# EAGLE schematic metronome (EAGLE 6.6.0)
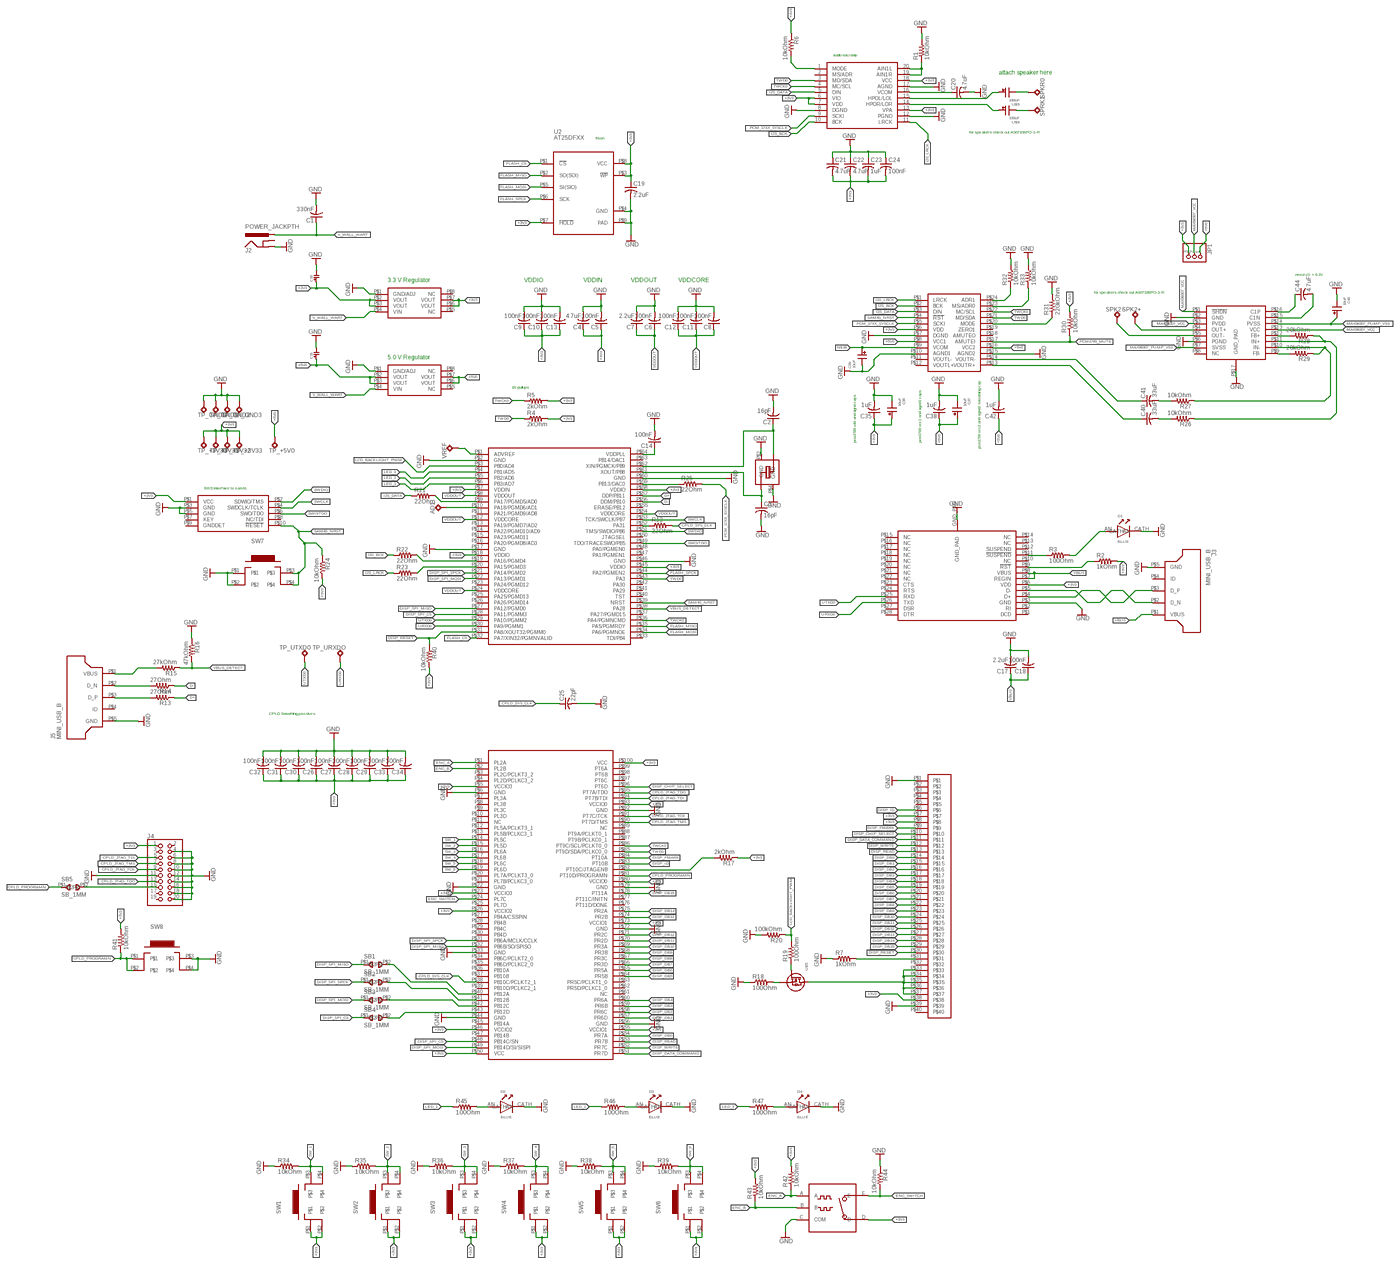
[diagram p0: schematic, sheet 1, overview]
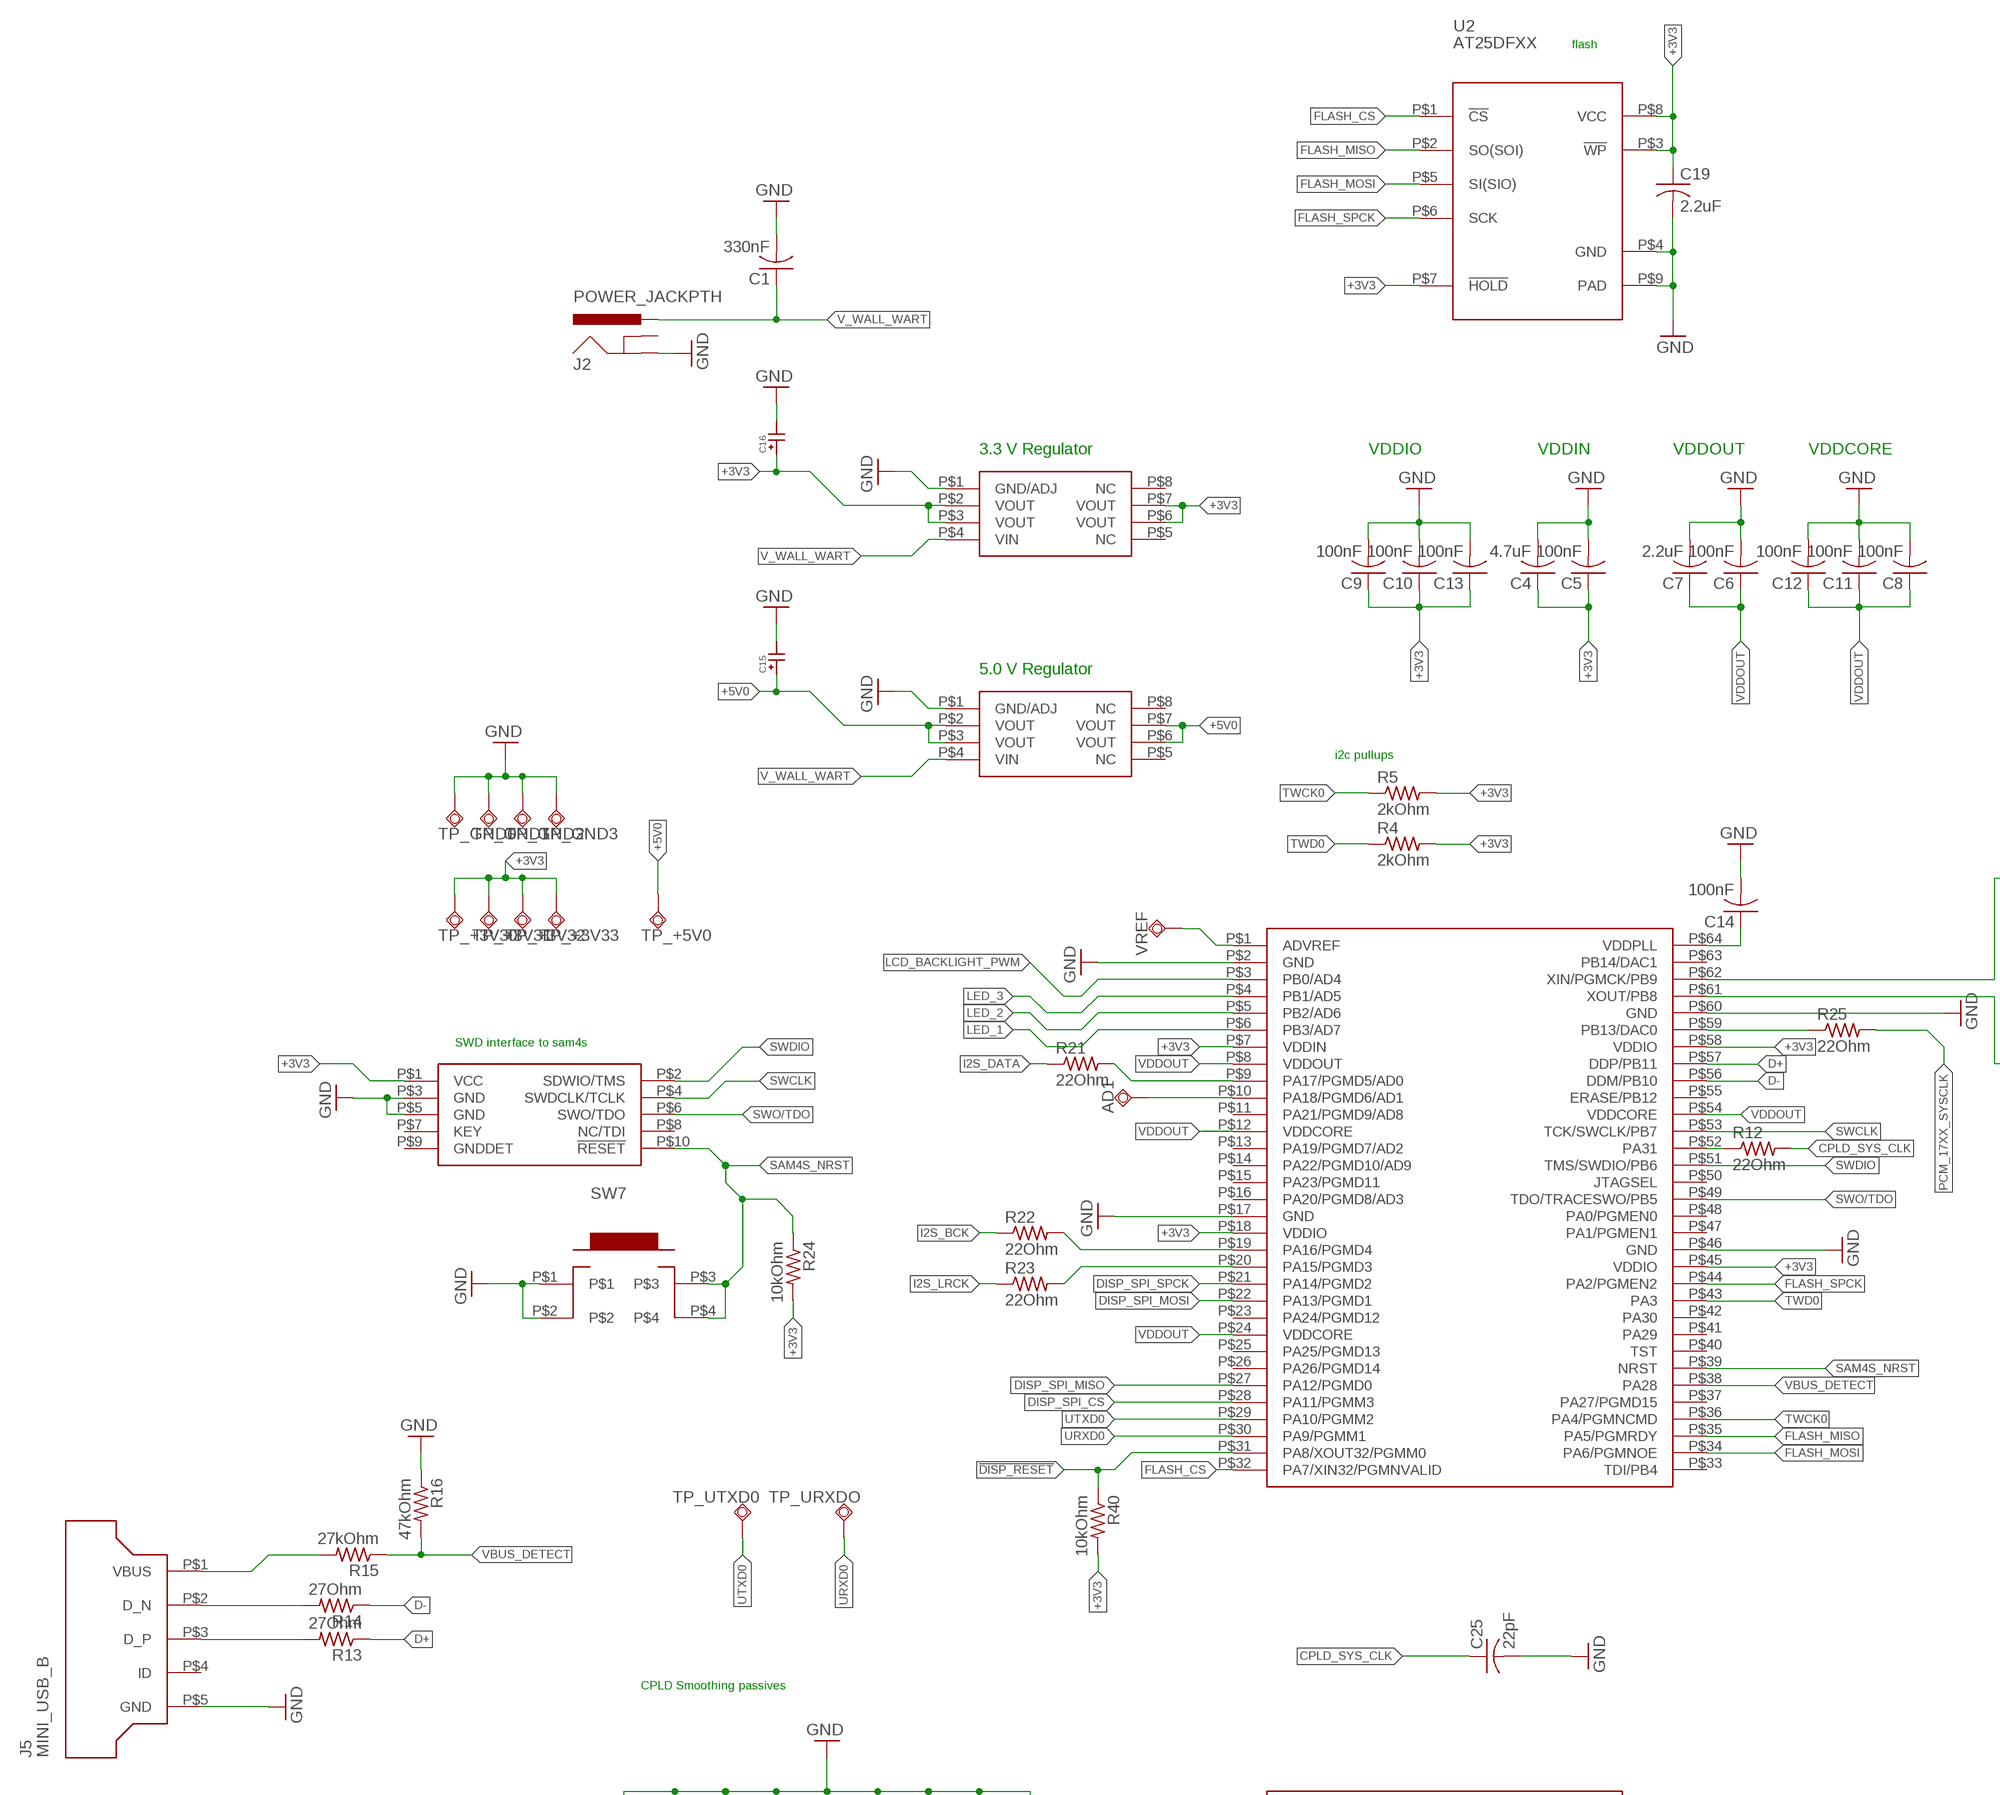
[diagram p1: schematic, sheet 1, part 1 of 4]
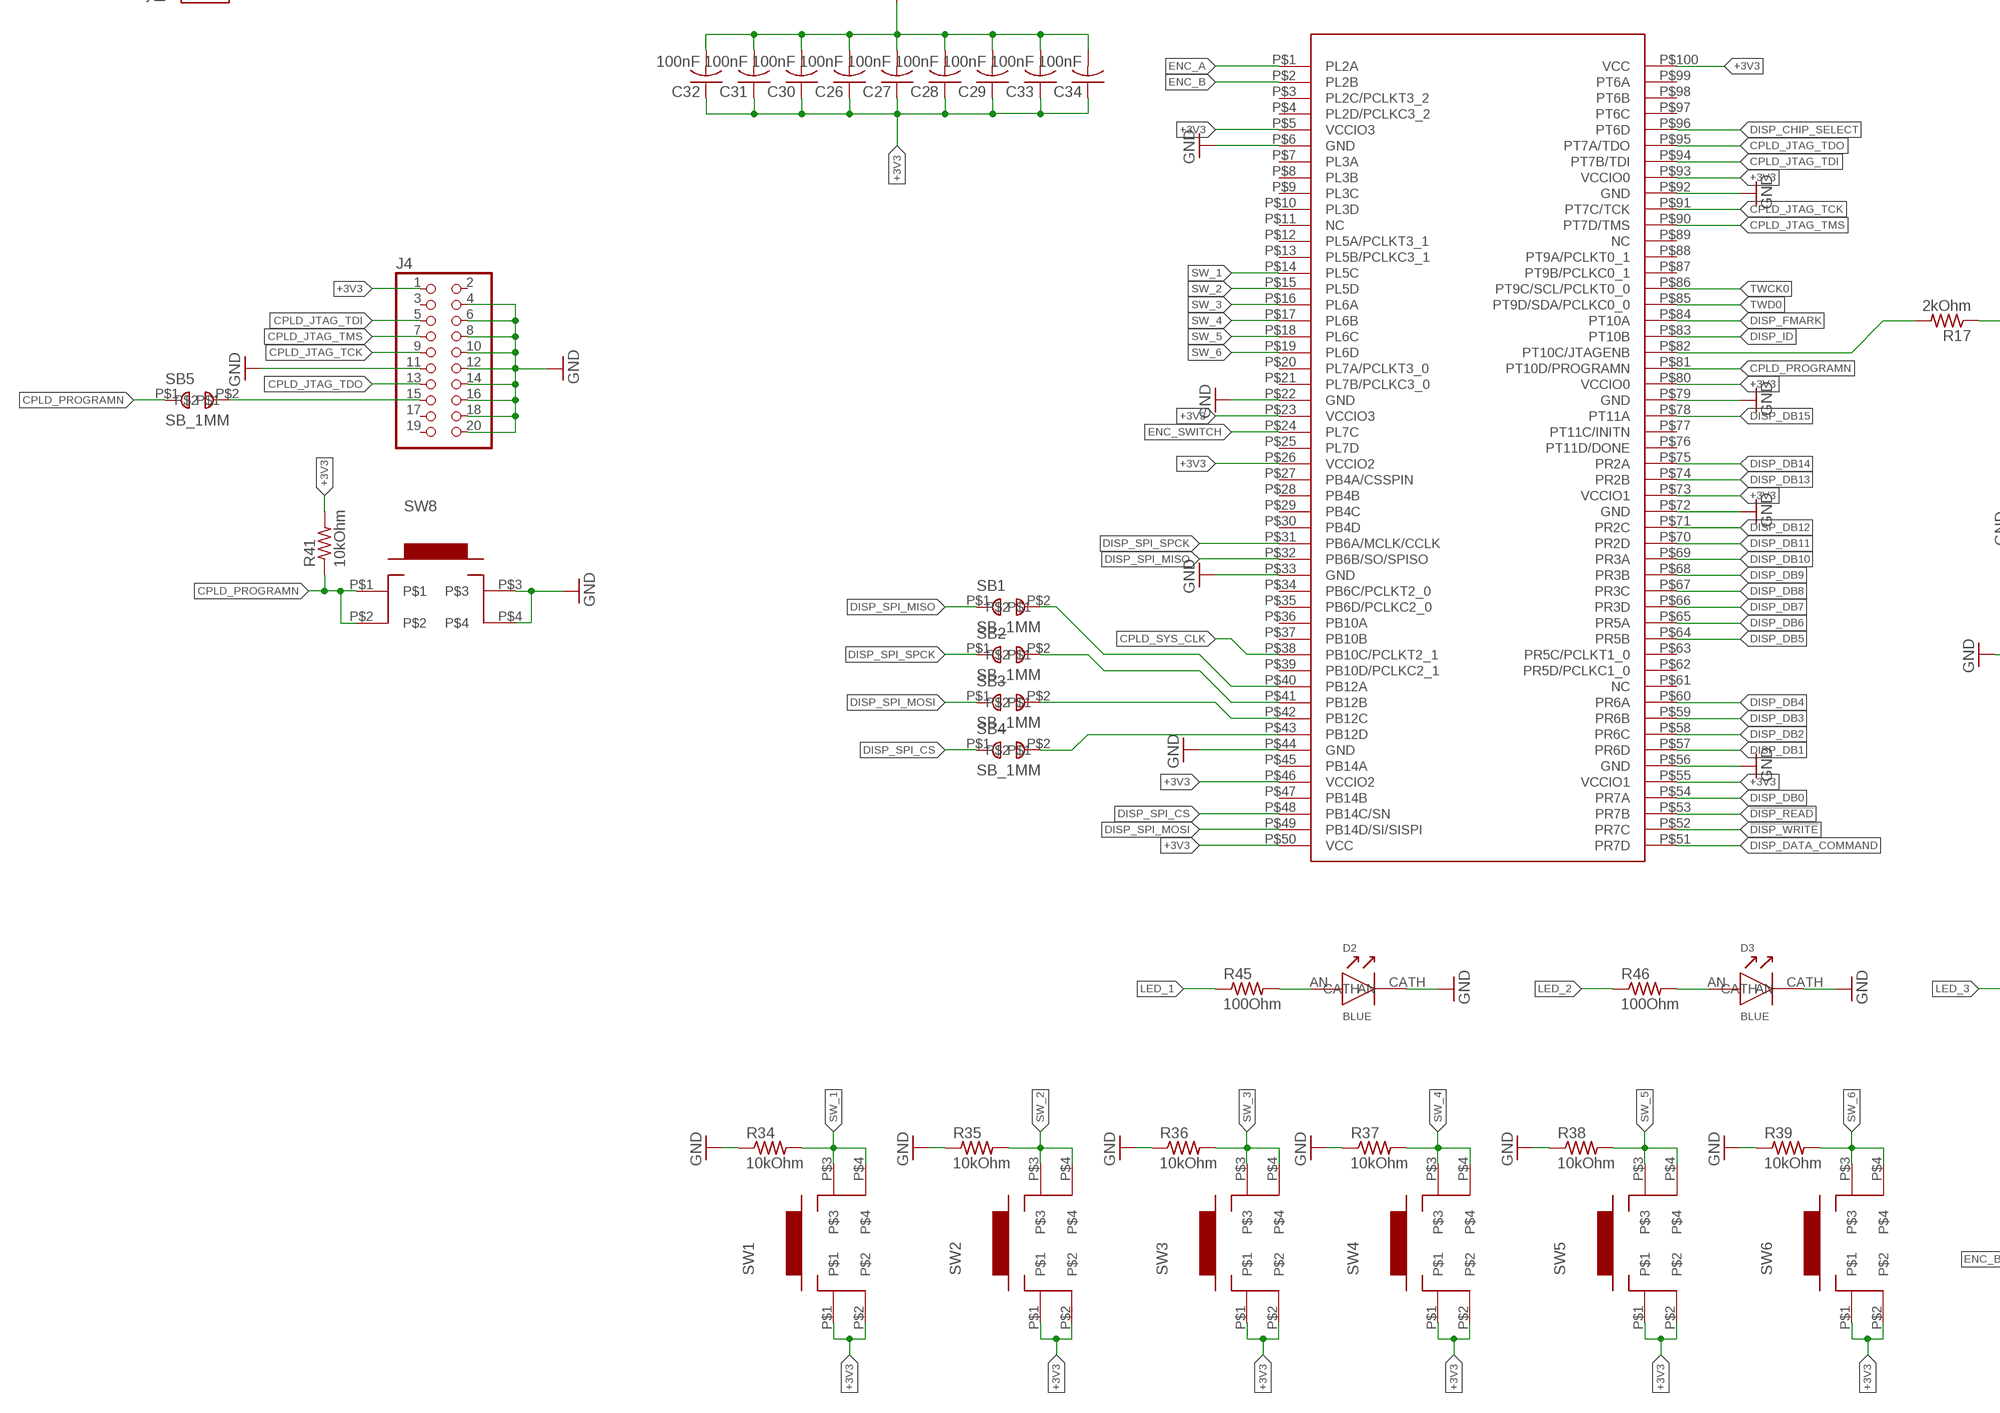
[diagram p2: schematic, sheet 1, part 2 of 4]
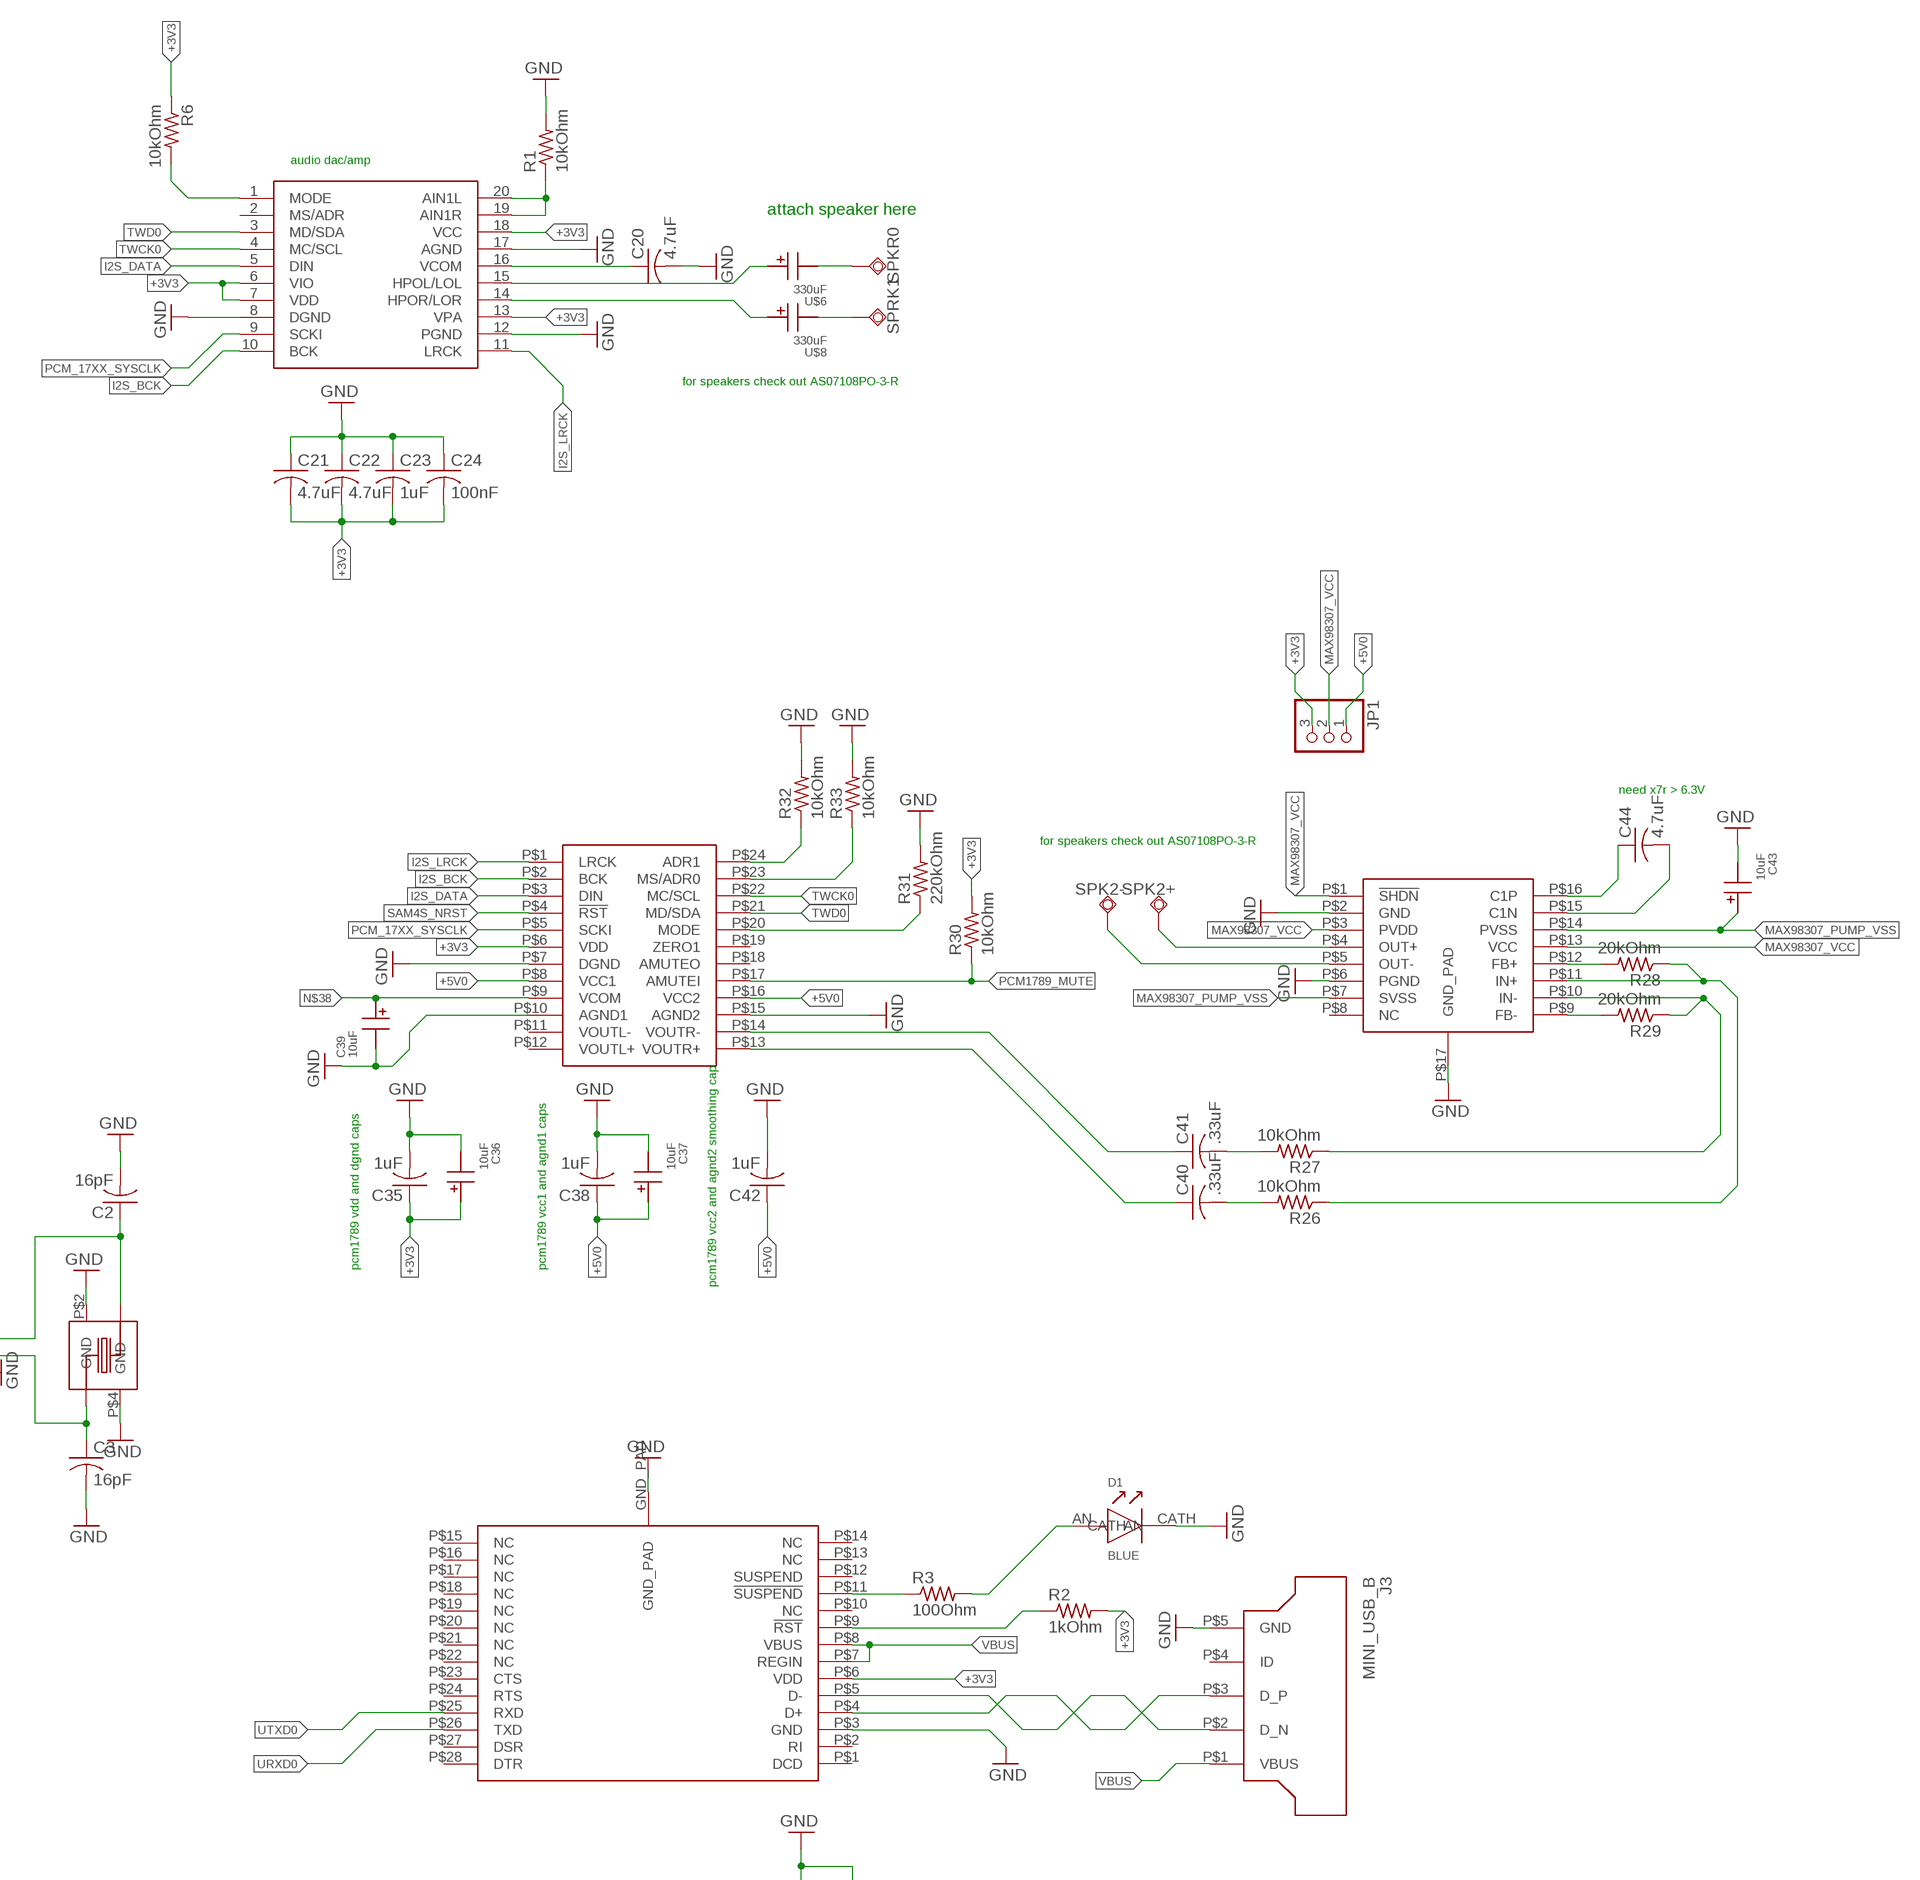
[diagram p3: schematic, sheet 1, part 3 of 4]
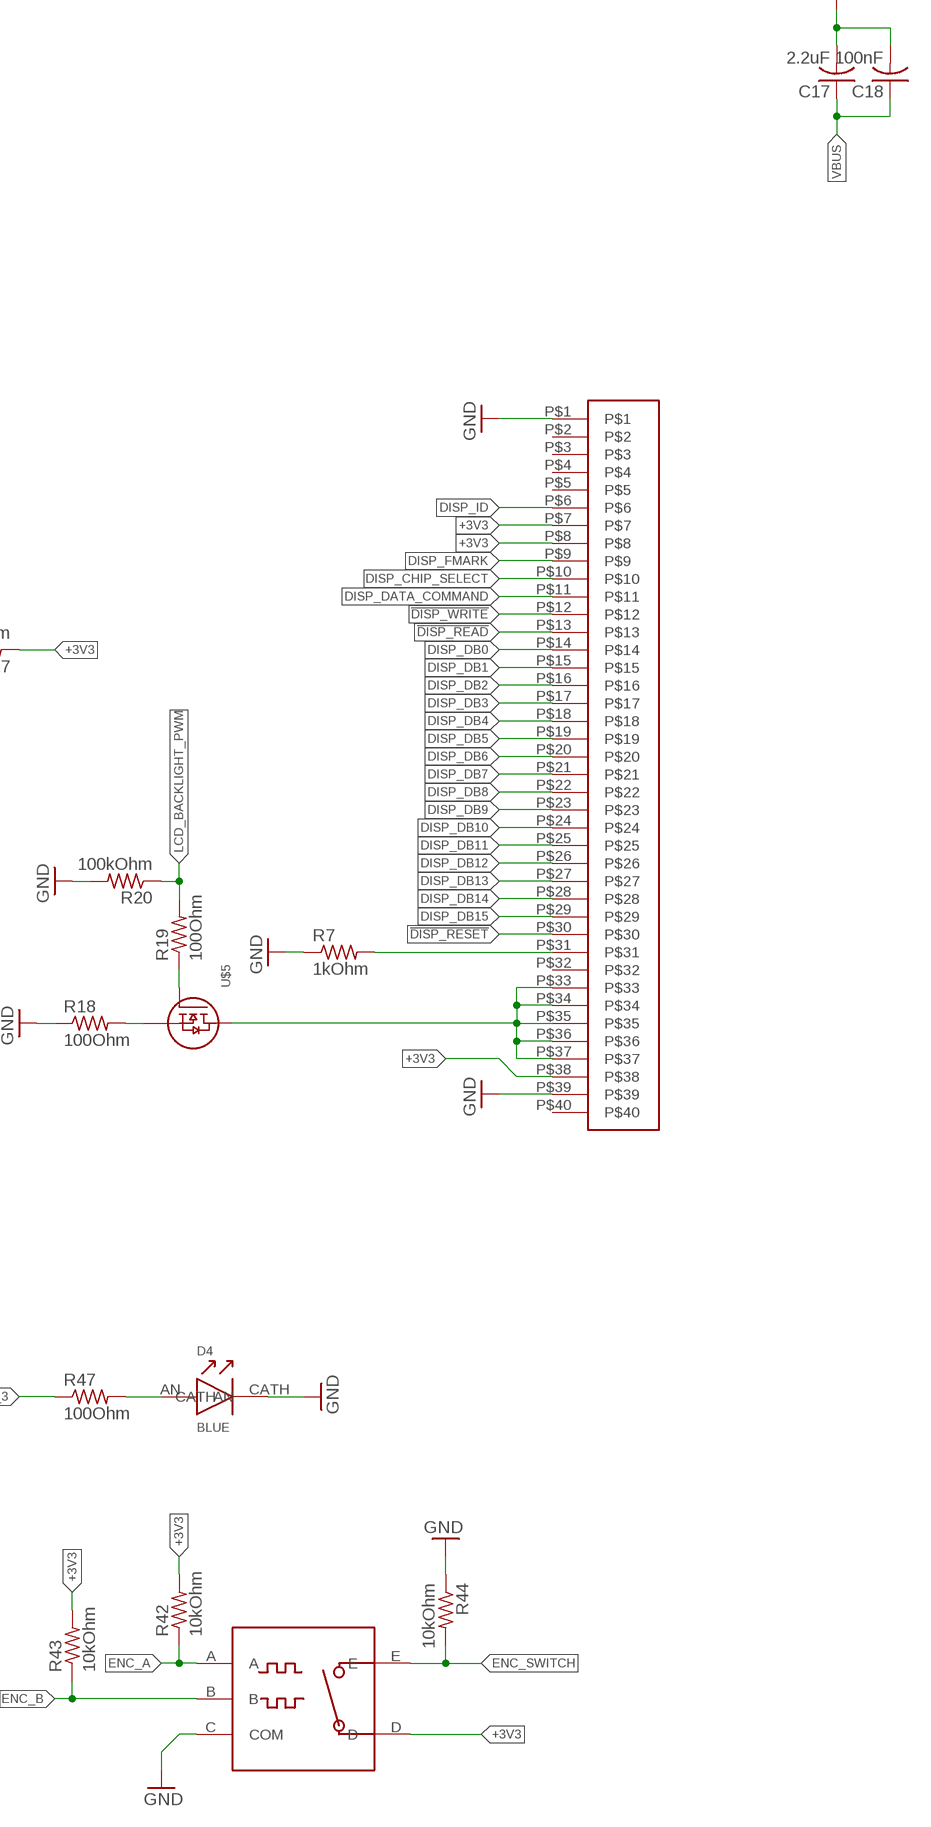
[diagram p4: schematic, sheet 1, part 4 of 4]

## Parts
3.3_V_REG  MC33269D-3.3GOS-ND  [ON_SEMICONDUCTOR_MC33269]
5.0_V_REG  MC33269D-5.0GOS-ND  [ON_SEMICONDUCTOR_MC33269]
AD1  TPSQTP13SQ  [TP13SQ]
C1  330nF  C-USC0402  [C0402]
C2  16pF  C-USC0402  [C0402]
C3  16pF  C-USC0402  [C0402]
C4  4.7uF  C-USC0603  [C0603]
C5  100nF  C-USC0402  [C0402]
C6  100nF  C-USC0402  [C0402]
C7  2.2uF  C-USC0603  [C0603]
C8  100nF  C-USC0402  [C0402]
C9  100nF  C-USC0402  [C0402]
C10  100nF  C-USC0402  [C0402]
C11  100nF  C-USC0402  [C0402]
C12  100nF  C-USC0402  [C0402]
C13  100nF  C-USC0402  [C0402]
C14  100nF  C-USC0402  [C0402]
C15  KEMET_T491A  [KEMET_T491A]
C16  KEMET_T491A  [KEMET_T491A]
C17  2.2uF  C-USC0603  [C0603]
C18  100nF  C-USC0402  [C0402]
C19  2.2uF  C-USC0603  [C0603]
C20  4.7uF  C-USC0402  [C0402]
C21  4.7uF  C-USC0402  [C0402]
C22  4.7uF  C-USC0402  [C0402]
C23  1uF  C-USC0402  [C0402]
C24  100nF  C-USC0402  [C0402]
C25  22pF  C-USC0402  [C0402]
C26  100nF  C-USC0402  [C0402]
C27  100nF  C-USC0402  [C0402]
C28  100nF  C-USC0402  [C0402]
C29  100nF  C-USC0402  [C0402]
C30  100nF  C-USC0402  [C0402]
C31  100nF  C-USC0402  [C0402]
C32  100nF  C-USC0402  [C0402]
C33  100nF  C-USC0402  [C0402]
C34  100nF  C-USC0402  [C0402]
C35  1uF  C-USC0402  [C0402]
C36  10uF  PANASONIC_HB1C100AR  [PANASONIC_EEEHB100AR]
C37  10uF  PANASONIC_HB1C100AR  [PANASONIC_EEEHB100AR]
C38  1uF  C-USC0402  [C0402]
C39  10uF  PANASONIC_HB1C100AR  [PANASONIC_EEEHB100AR]
C40  .33uF  C-USC0402  [C0402]
C41  .33uF  C-USC0402  [C0402]
C42  1uF  C-USC0402  [C0402]
C43  10uF  PANASONIC_HB1C100AR  [PANASONIC_EEEHB100AR]
C44  4.7uF  C-USC0603  [C0603]
D1  BLUE  LED0603  [D0603]
D2  BLUE  LED0603  [D0603]
D3  BLUE  LED0603  [D0603]
D4  BLUE  LED0603  [D0603]
J1  FCI_CORTEX_SWD_CONNECTOR  [FCI_10_PIN_SMD_0.5]
J2  POWER_JACKPTH  [POWER_JACK_PTH]
J3  MINI_USB_B  [UX60SC-MB-5ST]
J4  PINHD-2X10  [2X10]
J5  MINI_USB_B  [UX60SC-MB-5ST]
JP1  PINHD-1X3  [1X03]
R1  10kOhm  R-US_R0402  [R0402]
R2  1kOhm  R-US_R0402  [R0402]
R3  100Ohm  R-US_R0402  [R0402]
R4  2kOhm  R-US_R0402  [R0402]
R5  2kOhm  R-US_R0402  [R0402]
R6  10kOhm  R-US_R0402  [R0402]
R7  1kOhm  R-US_R0402  [R0402]
R12  22Ohm  R-US_R0402  [R0402]
R13  27Ohm  R-US_R0402  [R0402]
R14  27Ohm  R-US_R0402  [R0402]
R15  27kOhm  R-US_R0402  [R0402]
R16  47kOhm  R-US_R0402  [R0402]
R17  2kOhm  R-US_R0402  [R0402]
R18  100Ohm  R-US_R0402  [R0402]
R19  100Ohm  R-US_R0402  [R0402]
R20  100kOhm  R-US_R0402  [R0402]
R21  22Ohm  R-US_R0402  [R0402]
R22  22Ohm  R-US_R0402  [R0402]
R23  22Ohm  R-US_R0402  [R0402]
R24  10kOhm  R-US_R0402  [R0402]
R25  22Ohm  R-US_R0402  [R0402]
R26  10kOhm  R-US_R0402  [R0402]
R27  10kOhm  R-US_R0402  [R0402]
R28  20kOhm  R-US_R0402  [R0402]
R29  20kOhm  R-US_R0402  [R0402]
R30  10kOhm  R-US_R0402  [R0402]
R31  220kOhm  R-US_R0402  [R0402]
R32  10kOhm  R-US_R0402  [R0402]
R33  10kOhm  R-US_R0402  [R0402]
R34  10kOhm  R-US_R0402  [R0402]
R35  10kOhm  R-US_R0402  [R0402]
R36  10kOhm  R-US_R0402  [R0402]
R37  10kOhm  R-US_R0402  [R0402]
R38  10kOhm  R-US_R0402  [R0402]
R39  10kOhm  R-US_R0402  [R0402]
R40  10kOhm  R-US_R0402  [R0402]
R41  10kOhm  R-US_R0402  [R0402]
R42  10kOhm  R-US_R0402  [R0402]
R43  10kOhm  R-US_R0402  [R0402]
R44  10kOhm  R-US_R0402  [R0402]
R45  100Ohm  R-US_R0402  [R0402]
R46  100Ohm  R-US_R0402  [R0402]
R47  100Ohm  R-US_R0402  [R0402]
SB1  SB_1MM  [SB_1MM]
SB2  SB_1MM  [SB_1MM]
SB3  SB_1MM  [SB_1MM]
SB4  SB_1MM  [SB_1MM]
SB5  SB_1MM  [SB_1MM]
SPK2+  TPSQTP20SQ  [TP20SQ]
SPK2-  TPSQTP20SQ  [TP20SQ]
SPKR0  TPSQTP20SQ  [TP20SQ]
SPRK1  TPSQTP20SQ  [TP20SQ]
SW1  FSMJSMA  [FSMJSMA]
SW2  FSMJSMA  [FSMJSMA]
SW3  FSMJSMA  [FSMJSMA]
SW4  FSMJSMA  [FSMJSMA]
SW5  FSMJSMA  [FSMJSMA]
SW6  FSMJSMA  [FSMJSMA]
SW7  FSMJSMA  [FSMJSMA]
SW8  FSMJSMA  [FSMJSMA]
TP_+3V30  TPSQTP20SQ  [TP20SQ]
TP_+3V31  TPSQTP20SQ  [TP20SQ]
TP_+3V32  TPSQTP20SQ  [TP20SQ]
TP_+3V33  TPSQTP20SQ  [TP20SQ]
TP_+5V0  TPSQTP20SQ  [TP20SQ]
TP_GND0  TPSQTP20SQ  [TP20SQ]
TP_GND1  TPSQTP20SQ  [TP20SQ]
TP_GND2  TPSQTP20SQ  [TP20SQ]
TP_GND3  TPSQTP20SQ  [TP20SQ]
TP_URXDO  TPSQTP20SQ  [TP20SQ]
TP_UTXD0  TPSQTP20SQ  [TP20SQ]
U1  ATSAMD4S2BA-AU  [ATMEL_10X10_QFP_64]
U2  AT25DFXX1X-M  [8MA1-UDFN]
U$1  LATTICE_LCMXO2-640HC-4TG100C  [LATTICE_MACHXO_TQFP100]
U$2  TI_PCM1774  [TI_QFN_20]
U$3  ECS_ECS-120-20-33-CKM-TR  [ECS_ECX-32]
U$4  40_PIN_MOLEX_FFC  [40_PIN_MOLEX_FFC]
U$5  DIODES_INCORPORATED_2N7002-7-F  [DIODES_INCORPORATED_SOT23]
U$6  330uF  PANASONIC_EEEFT0JXXX  [PANASONIC_EEEFT0JXXX]
U$7  SILABS_CP2102  [SILABS_QFN28]
U$8  330uF  PANASONIC_EEEFT0JXXX  [PANASONIC_EEEFT0JXXX]
U$9  TI_PCM1789  [TI_PW_TSSOP_24]
U$10  MAXIM_MAX_98307  [MAXIM_16_TQFN_T1633-5]
U$11  BOURNS_PEC16-4215F-S0024  [BOURNS_PEC16-4XXXF-SXXXX]
VREF  TPSQTP13SQ  [TP13SQ]

## Nets
!DISP_READ!: U$1.P$53(PR7B) U$4.P$13
!DISP_RESET!: R40.1 U1.P$31(PA8/XOUT32/PGMM0) U$4.P$30
!DISP_WRITE!: U$1.P$52(PR7C) U$4.P$12
+3V3: 3.3_V_REG.P$2(VOUT) 3.3_V_REG.P$3(VOUT) 3.3_V_REG.P$6(VOUT) 3.3_V_REG.P$7(VOUT) C4.1 C5.1 C9.1 C10.1 C13.1 C16.POS C19.1 C21.2 C22.2 C23.2 C24.2 C26.1 C27.1 C28.1 C29.1 C30.1 C31.1 C32.1 C33.1 C34.1 C35.1 C36.POS J1.P$1(VCC) J4.1 JP1.3 R2.2 R4.2 R5.2 R6.1 R17.1 R24.2 R30.2 R40.2 R41.2 R42.2 R43.2 SW1.P$1 SW1.P$2 SW2.P$1 SW2.P$2 SW3.P$1 SW3.P$2 SW4.P$1 SW4.P$2 SW5.P$1 SW5.P$2 SW6.P$1 SW6.P$2 TP_+3V30.TP TP_+3V31.TP TP_+3V32.TP TP_+3V33.TP U1.P$7(VDDIN) U1.P$18(VDDIO) U1.P$45(VDDIO) U1.P$58(VDDIO) U2.P$3(!WP!) U2.P$7(!HOLD!) U2.P$8(VCC) U$1.P$5(VCCIO3) U$1.P$23(VCCIO3) U$1.P$26(VCCIO2) U$1.P$46(VCCIO2) U$1.P$50(VCC) U$1.P$55(VCCIO1) U$1.P$73(VCCIO1) U$1.P$80(VCCIO0) U$1.P$93(VCCIO0) U$1.P$100(VCC) U$2.6(VIO) U$2.7(VDD) U$2.13(VPA) U$2.18(VCC) U$4.P$7 U$4.P$8 U$4.P$38 U$7.P$6(VDD) U$9.P$6(VDD) U$11.D
+5V0: 5.0_V_REG.P$2(VOUT) 5.0_V_REG.P$3(VOUT) 5.0_V_REG.P$6(VOUT) 5.0_V_REG.P$7(VOUT) C15.POS C37.POS C38.1 C42.1 JP1.1 TP_+5V0.TP U$9.P$8(VCC1) U$9.P$16(VCC2)
CPLD_JTAG_TCK: J4.9 U$1.P$91(PT7C/TCK)
CPLD_JTAG_TDI: J4.5 U$1.P$94(PT7B/TDI)
CPLD_JTAG_TDO: J4.13 U$1.P$95(PT7A/TDO)
CPLD_JTAG_TMS: J4.7 U$1.P$90(PT7D/TMS)
CPLD_PROGRAMN: R41.1 SB5.P$1 SW8.P$1 SW8.P$2 U$1.P$81(PT10D/PROGRAMN)
CPLD_SYS_CLK: C25.1 R12.2 U$1.P$38(PB10C/PCLKT2_1)
D+: R13.1 U1.P$57(DDP/PB11)
D-: R14.1 U1.P$56(DDM/PB10)
DISP_CHIP_SELECT: U$1.P$96(PT6D) U$4.P$10
DISP_DATA_COMMAND: U$1.P$51(PR7D) U$4.P$11
DISP_DB0: U$1.P$54(PR7A) U$4.P$14
DISP_DB1: U$1.P$57(PR6D) U$4.P$15
DISP_DB2: U$1.P$58(PR6C) U$4.P$16
DISP_DB3: U$1.P$59(PR6B) U$4.P$17
DISP_DB4: U$1.P$60(PR6A) U$4.P$18
DISP_DB5: U$1.P$64(PR5B) U$4.P$19
DISP_DB6: U$1.P$65(PR5A) U$4.P$20
DISP_DB7: U$1.P$66(PR3D) U$4.P$21
DISP_DB8: U$1.P$67(PR3C) U$4.P$22
DISP_DB9: U$1.P$68(PR3B) U$4.P$23
DISP_DB10: U$1.P$69(PR3A) U$4.P$24
DISP_DB11: U$1.P$70(PR2D) U$4.P$25
DISP_DB12: U$1.P$71(PR2C) U$4.P$26
DISP_DB13: U$1.P$74(PR2B) U$4.P$27
DISP_DB14: U$1.P$75(PR2A) U$4.P$28
DISP_DB15: U$1.P$78(PT11A) U$4.P$29
DISP_FMARK: U$1.P$84(PT10A) U$4.P$9
DISP_ID: U$1.P$83(PT10B) U$4.P$6
DISP_SPI_CS: SB4.P$1 U1.P$28(PA11/PGMM3) U$1.P$48(PB14C/SN)
DISP_SPI_MISO: SB1.P$1 U1.P$27(PA12/PGMD0) U$1.P$32(PB6B/SO/SPISO)
DISP_SPI_MOSI: SB3.P$1 U1.P$22(PA13/PGMD1) U$1.P$49(PB14D/SI/SISPI)
DISP_SPI_SPCK: SB2.P$1 U1.P$21(PA14/PGMD2) U$1.P$31(PB6A/MCLK/CCLK)
ENC_A: R42.1 U$1.P$1(PL2A) U$11.A
ENC_B: R43.1 U$1.P$2(PL2B) U$11.B
ENC_SWITCH: R44.2 U$1.P$24(PL7C) U$11.E
FLASH_CS: U1.P$32(PA7/XIN32/PGMNVALID) U2.P$1(!CS!)
FLASH_MISO: U1.P$35(PA5/PGMRDY) U2.P$2(SO(SOI))
FLASH_MOSI: U1.P$34(PA6/PGMNOE) U2.P$5(SI(SIO))
FLASH_SPCK: U1.P$44(PA2/PGMEN2) U2.P$6(SCK)
GND: 3.3_V_REG.P$1(GND/ADJ) 5.0_V_REG.P$1(GND/ADJ) C1.2 C2.2 C3.2 C4.2 C5.2 C6.2 C7.2 C8.2 C9.2 C10.2 C11.2 C12.2 C13.2 C14.2 C15.NEG C16.NEG C17.2 C18.2 C19.2 C20.2 C21.1 C22.1 C23.1 C24.1 C25.2 C26.2 C27.2 C28.2 C29.2 C30.2 C31.2 C32.2 C33.2 C34.2 C35.2 C36.NEG C37.NEG C38.2 C39.NEG C42.2 C43.NEG D1.CATH D2.CATH D3.CATH D4.CATH J1.P$3(GND) J1.P$5(GND) J2.GND J3.P$5(GND) J4.4 J4.6 J4.8 J4.10 J4.11 J4.12 J4.14 J4.16 J4.18 J4.20 J5.P$5(GND) R1.2 R7.1 R16.1 R18.1 R20.2 R31.2 R32.2 R33.2 R34.1 R35.1 R36.1 R37.1 R38.1 R39.1 R44.1 SW7.P$1 SW7.P$2 SW8.P$3 SW8.P$4 TP_GND0.TP TP_GND1.TP TP_GND2.TP TP_GND3.TP U1.P$2(GND) U1.P$17(GND) U1.P$46(GND) U1.P$60(GND) U2.P$4(GND) U2.P$9(PAD) U$1.P$6(GND) U$1.P$22(GND) U$1.P$33(GND) U$1.P$44(GND) U$1.P$56(GND) U$1.P$72(GND) U$1.P$79(GND) U$1.P$92(GND) U$2.8(DGND) U$2.12(PGND) U$2.17(AGND) U$3.P$2(GND) U$3.P$4(GND) U$4.P$1 U$4.P$39 U$7.GND_PAD U$7.P$3(GND) U$9.P$7(DGND) U$9.P$10(AGND1) U$9.P$15(AGND2) U$10.P$2(GND) U$10.P$6(PGND) U$10.P$17(GND_PAD) U$11.C(COM)
I2S_BCK: R22.1 U$2.10(BCK) U$9.P$2(BCK)
I2S_DATA: R21.1 U$2.5(DIN) U$9.P$3(DIN)
I2S_DATA_MCU: R21.2 U1.P$9(PA17/PGMD5/AD0)
I2S_LR_SELECT_MCU: R23.2 U1.P$20(PA15/PGMD3)
I2S_LRCK: R23.1 U$2.11(LRCK) U$9.P$1(LRCK)
LCD_BACKLIGHT_PWM: R19.2 R20.1 U1.P$3(PB0/AD4)
LED_1: R45.1 U1.P$6(PB3/AD7)
LED_2: R46.1 U1.P$5(PB2/AD6)
LED_3: R47.1 U1.P$4(PB1/AD5)
MAX98307_PUMP_VSS: C43.POS U$10.P$7(SVSS) U$10.P$14(PVSS)
MAX98307_VCC: JP1.2 U$10.P$1(!SHDN!) U$10.P$3(PVDD) U$10.P$13(VCC)
N$1: R2.1 U$7.P$9(!RST!)
N$2: SB2.P$2 U$1.P$41(PB12B)
N$3: SPKR0.TP U$6.NEG
N$4: R3.1 U$7.P$11(!SUSPEND!)
N$5: D1.AN R3.2
N$6: C14.1 U1.P$64(VDDPLL)
N$7: U1.P$1(ADVREF) VREF.TP
N$8: AD1.TP U1.P$10(PA18/PGMD6/AD1)
N$9: R12.1 U1.P$52(PA31)
N$10: SB4.P$2 U$1.P$43(PB12D)
N$11: SB3.P$2 U$1.P$42(PB12C)
N$13: J5.P$3(D_P) R13.2
N$15: R7.2 U$4.P$31
N$16: J5.P$2(D_N) R14.2
N$17: R17.2 U$1.P$82(PT10C/JTAGENB)
N$18: U$4.P$33 U$4.P$34 U$4.P$35 U$4.P$36 U$4.P$37 U$5.P$3(DRAIN)
N$19: J5.P$1(VBUS) R15.2
N$20: R1.1 U$2.19(AIN1R) U$2.20(AIN1L)
N$21: R6.2 U$2.1(MODE)
N$22: R18.2 U$5.P$2(SOURCE)
N$23: C20.1 U$2.16(VCOM)
N$24: R19.1 U$5.P$1(GATE)
N$25: SB1.P$2 U$1.P$40(PB12A)
N$26: U$2.15(HPOL/LOL) U$6.POS
N$27: U$2.14(HPOR/LOR) U$8.POS
N$28: SPRK1.TP U$8.NEG
N$29: R22.2 U1.P$19(PA16/PGMD4)
N$30: R25.1 U1.P$59(PB13/DAC0)
N$31: C41.1 U$9.P$14(VOUTR-)
N$32: C40.1 U$9.P$13(VOUTR+)
N$33: C41.2 R27.2
N$34: C40.2 R26.2
N$35: R26.1 R28.1 U$10.P$11(IN+)
N$36: R27.1 R29.1 U$10.P$10(IN-)
N$37: R28.2 U$10.P$12(FB+)
N$38: C39.POS U$9.P$9(VCOM)
N$39: R29.2 U$10.P$9(FB-)
N$42: R31.1 U$9.P$20(MODE)
N$43: R32.1 U$9.P$24(ADR1)
N$44: D2.AN R45.2
N$45: D3.AN R46.2
N$46: SPK2+.TP U$10.P$4(OUT+)
N$47: SPK2-.TP U$10.P$5(OUT-)
N$48: D4.AN R47.2
N$49: J4.15 SB5.P$2
N$52: R33.1 U$9.P$23(MS/ADR0)
N$53: C44.2 U$10.P$15(C1N)
N$54: C44.1 U$10.P$16(C1P)
PCM1789_MUTE: R30.1 U$9.P$17(AMUTEI)
PCM_17XX_SYSCLK: R25.2 U$2.9(SCKI) U$9.P$5(SCKI)
SAM4S_NRST: J1.P$10(!RESET!) R24.1 SW7.P$3 SW7.P$4 U1.P$39(NRST) U$9.P$4(!RST!)
SERIAL_USB+: J3.P$3(D_P) U$7.P$4(D+)
SERIAL_USB-: J3.P$2(D_N) U$7.P$5(D-)
SW_1: R34.2 SW1.P$3 SW1.P$4 U$1.P$14(PL5C)
SW_2: R35.2 SW2.P$3 SW2.P$4 U$1.P$15(PL5D)
SW_3: R36.2 SW3.P$3 SW3.P$4 U$1.P$16(PL6A)
SW_4: R37.2 SW4.P$3 SW4.P$4 U$1.P$17(PL6B)
SW_5: R38.2 SW5.P$3 SW5.P$4 U$1.P$18(PL6C)
SW_6: R39.2 SW6.P$3 SW6.P$4 U$1.P$19(PL6D)
SWCLK: J1.P$4(SWDCLK/TCLK) U1.P$53(TCK/SWCLK/PB7)
SWDIO: J1.P$2(SDWIO/TMS) U1.P$51(TMS/SWDIO/PB6)
SWO/TDO: J1.P$6(SWO/TDO) U1.P$49(TDO/TRACESWO/PB5)
TWCK0: R5.1 U1.P$36(PA4/PGMNCMD) U$1.P$86(PT9C/SCL/PCLKT0_0) U$2.4(MC/SCL) U$9.P$22(MC/SCL)
TWD0: R4.1 U1.P$43(PA3) U$1.P$85(PT9D/SDA/PCLKC0_0) U$2.3(MD/SDA) U$9.P$21(MD/SDA)
URXD0: TP_URXDO.TP U1.P$30(PA9/PGMM1) U$7.P$26(TXD)
UTXD0: TP_UTXD0.TP U1.P$29(PA10/PGMM2) U$7.P$25(RXD)
V_WALL_WART: 3.3_V_REG.P$4(VIN) 5.0_V_REG.P$4(VIN) C1.1 J2.PWR
VBUS: C17.1 C18.1 J3.P$1(VBUS) U$7.P$7(REGIN) U$7.P$8(VBUS)
VBUS_DETECT: R15.1 R16.2 U1.P$38(PA28)
VDDOUT: C6.1 C7.1 C8.1 C11.1 C12.1 U1.P$8(VDDOUT) U1.P$12(VDDCORE) U1.P$24(VDDCORE) U1.P$54(VDDCORE)
XIN: C2.1 U1.P$62(XIN/PGMCK/PB9) U$3.P$1
XOUT: C3.1 U1.P$61(XOUT/PB8) U$3.P$3
Unconnected: 3.3_V_REG.P$5(NC) 3.3_V_REG.P$8(NC) 5.0_V_REG.P$5(NC) 5.0_V_REG.P$8(NC) J1.P$7(KEY) J1.P$8(NC/TDI) J1.P$9(GNDDET) J2.GNDBREAK J3.P$4(ID) J4.2 J4.3 J4.17 J4.19 J5.P$4(ID) U1.P$11(PA21/PGMD9/AD8) U1.P$13(PA19/PGMD7/AD2) U1.P$14(PA22/PGMD10/AD9) U1.P$15(PA23/PGMD11) U1.P$16(PA20/PGMD8/AD3) U1.P$23(PA24/PGMD12) U1.P$25(PA25/PGMD13) U1.P$26(PA26/PGMD14) U1.P$33(TDI/PB4) U1.P$37(PA27/PGMD15) U1.P$40(TST) U1.P$41(PA29) U1.P$42(PA30) U1.P$47(PA1/PGMEN1) U1.P$48(PA0/PGMEN0) U1.P$50(JTAGSEL) U1.P$55(ERASE/PB12) U1.P$63(PB14/DAC1) U$1.P$3(PL2C/PCLKT3_2) U$1.P$4(PL2D/PCLKC3_2) U$1.P$7(PL3A) U$1.P$8(PL3B) U$1.P$9(PL3C) U$1.P$10(PL3D) U$1.P$11(NC) U$1.P$12(PL5A/PCLKT3_1) U$1.P$13(PL5B/PCLKC3_1) U$1.P$20(PL7A/PCLKT3_0) U$1.P$21(PL7B/PCLKC3_0) U$1.P$25(PL7D) U$1.P$27(PB4A/CSSPIN) U$1.P$28(PB4B) U$1.P$29(PB4C) U$1.P$30(PB4D) U$1.P$34(PB6C/PCLKT2_0) U$1.P$35(PB6D/PCLKC2_0) U$1.P$36(PB10A) U$1.P$37(PB10B) U$1.P$39(PB10D/PCLKC2_1) U$1.P$45(PB14A) U$1.P$47(PB14B) U$1.P$61(NC) U$1.P$62(PR5D/PCLKC1_0) U$1.P$63(PR5C/PCLKT1_0) U$1.P$76(PT11D/DONE) U$1.P$77(PT11C/INITN) U$1.P$87(PT9B/PCLKC0_1) U$1.P$88(PT9A/PCLKT0_1) U$1.P$89(NC) U$1.P$97(PT6C) U$1.P$98(PT6B) U$1.P$99(PT6A) U$2.2(MS/ADR) U$4.P$2 U$4.P$3 U$4.P$4 U$4.P$5 U$4.P$32 U$4.P$40 U$7.P$1(DCD) U$7.P$2(RI) U$7.P$10(NC) U$7.P$12(SUSPEND) U$7.P$13(NC) U$7.P$14(NC) U$7.P$15(NC) U$7.P$16(NC) U$7.P$17(NC) U$7.P$18(NC) U$7.P$19(NC) U$7.P$20(NC) U$7.P$21(NC) U$7.P$22(NC) U$7.P$23(CTS) U$7.P$24(RTS) U$7.P$27(DSR) U$7.P$28(DTR) U$9.P$11(VOUTL-) U$9.P$12(VOUTL+) U$9.P$18(AMUTEO) U$9.P$19(ZERO1) U$10.P$8(NC)

## Notes on the sheet
- audio dac/amp
- attach speaker here
- for speakers check out AS07108PO-3-R
- flash
- need x7r > 6.3V
- 3.3 V Regulator | VDDIO | VDDIN | VDDOUT | VDDCORE
- for speakers check out AS07108PO-3-R
- 5.0 V Regulator
- i2c pullups
- pcm1789 vdd and dgnd caps | pcm1789 vcc1 and agnd1 caps
- pcm1789 vcc2 and agnd2 smoothing cap
- SWD interface to sam4s
- CPLD Smoothing passives

## Library data of the parts
3.3_V_REG = john_mamish_regulator_library:MC33269D-3.3GOS-ND
5.0_V_REG = john_mamish_regulator_library:MC33269D-5.0GOS-ND
AD1 SPK2+ SPK2- SPKR0 SPRK1 TP_+3V30-TP_+3V33 TP_+5V0 TP_GND0 TP_GND1-TP_GND3 TP_URXDO TP_UTXD0 VREF = testpad:TPSQ: Test pad
C1-C14 C17-C35 C38 C40-C42 C44 = adafruit:C-US: CAPACITOR, American symbol
C15 C16 = john_mamish_passives_library:KEMET_T491A
C36 C37 C39 C43 = john_mamish_passives_library:PANASONIC_HB1C100AR
D1-D4 = john_mamish_assorted_analog_library:LED0603
J1 = john_mamish_connector_library:FCI_CORTEX_SWD_CONNECTOR
J2 = SparkFun-Connectors:POWER_JACK: Power Jack This is the standard 5.5mm barrel jack for power. The PTH is the most common, proven, reliable, footprint. The Slot footprint only works if the mill layer is transmitted to the PCB fab house so be warned. Spark Fun Electronics SKU : PRT-00119 SMT: CONN-08106 Mating wall wart : TOL-00298 (and others)
J3 J5 = john_mamish_connector_library:MINI_USB_B: Mini USB-B Surface Mount; DIGIKEY_PN: H11671CT-ND
J4 = pinhead:PINHD-2X10: PIN HEADER
JP1 = pinhead:PINHD-1X3: PIN HEADER
R1-R7 R12-R47 = adafruit:R-US_: RESISTOR, American symbol
SB1-SB5 = john_mamish_passives_library:SB_1MM: 1MM Normally Open Solder Bridge
SW1-SW8 = john_mamish_passives_library:FSMJSMA: Tactile Switch OFF-MOM, Surface Mount
U1 = my_assorted_parts:ATSAMD4S2BA-AU
U2 = john_mamish_assorted_digital_library:AT25DFXX1X-M: Serial Peripheral Interface Serial Flash Memory
U$1 = john_mamish_mcu_library:LATTICE_LCMXO2-640HC-4TG100C
U$2 = my_assorted_parts:TI_PCM1774
U$3 = john_mamish_xtals_and_osc_library:ECS_ECS-120-20-33-CKM-TR
U$4 = john_mamish_connector_library:40_PIN_MOLEX_FFC
U$5 = john_mamish_assorted_analog_library:DIODES_INCORPORATED_2N7002-7-F
U$6 U$8 = john_mamish_passives_library:PANASONIC_EEEFT0JXXX
U$7 = john_mamish_assorted_digital_library:SILABS_CP2102
U$9 = john_mamish_dacs_and_adcs:TI_PCM1789
U$10 = john_mamish_assorted_analog_library:MAXIM_MAX_98307
U$11 = john_mamish_passives_library:BOURNS_PEC16-4215F-S0024